# EAGLE design Power_Distro_Board_V3 (EAGLE 8.3.2)
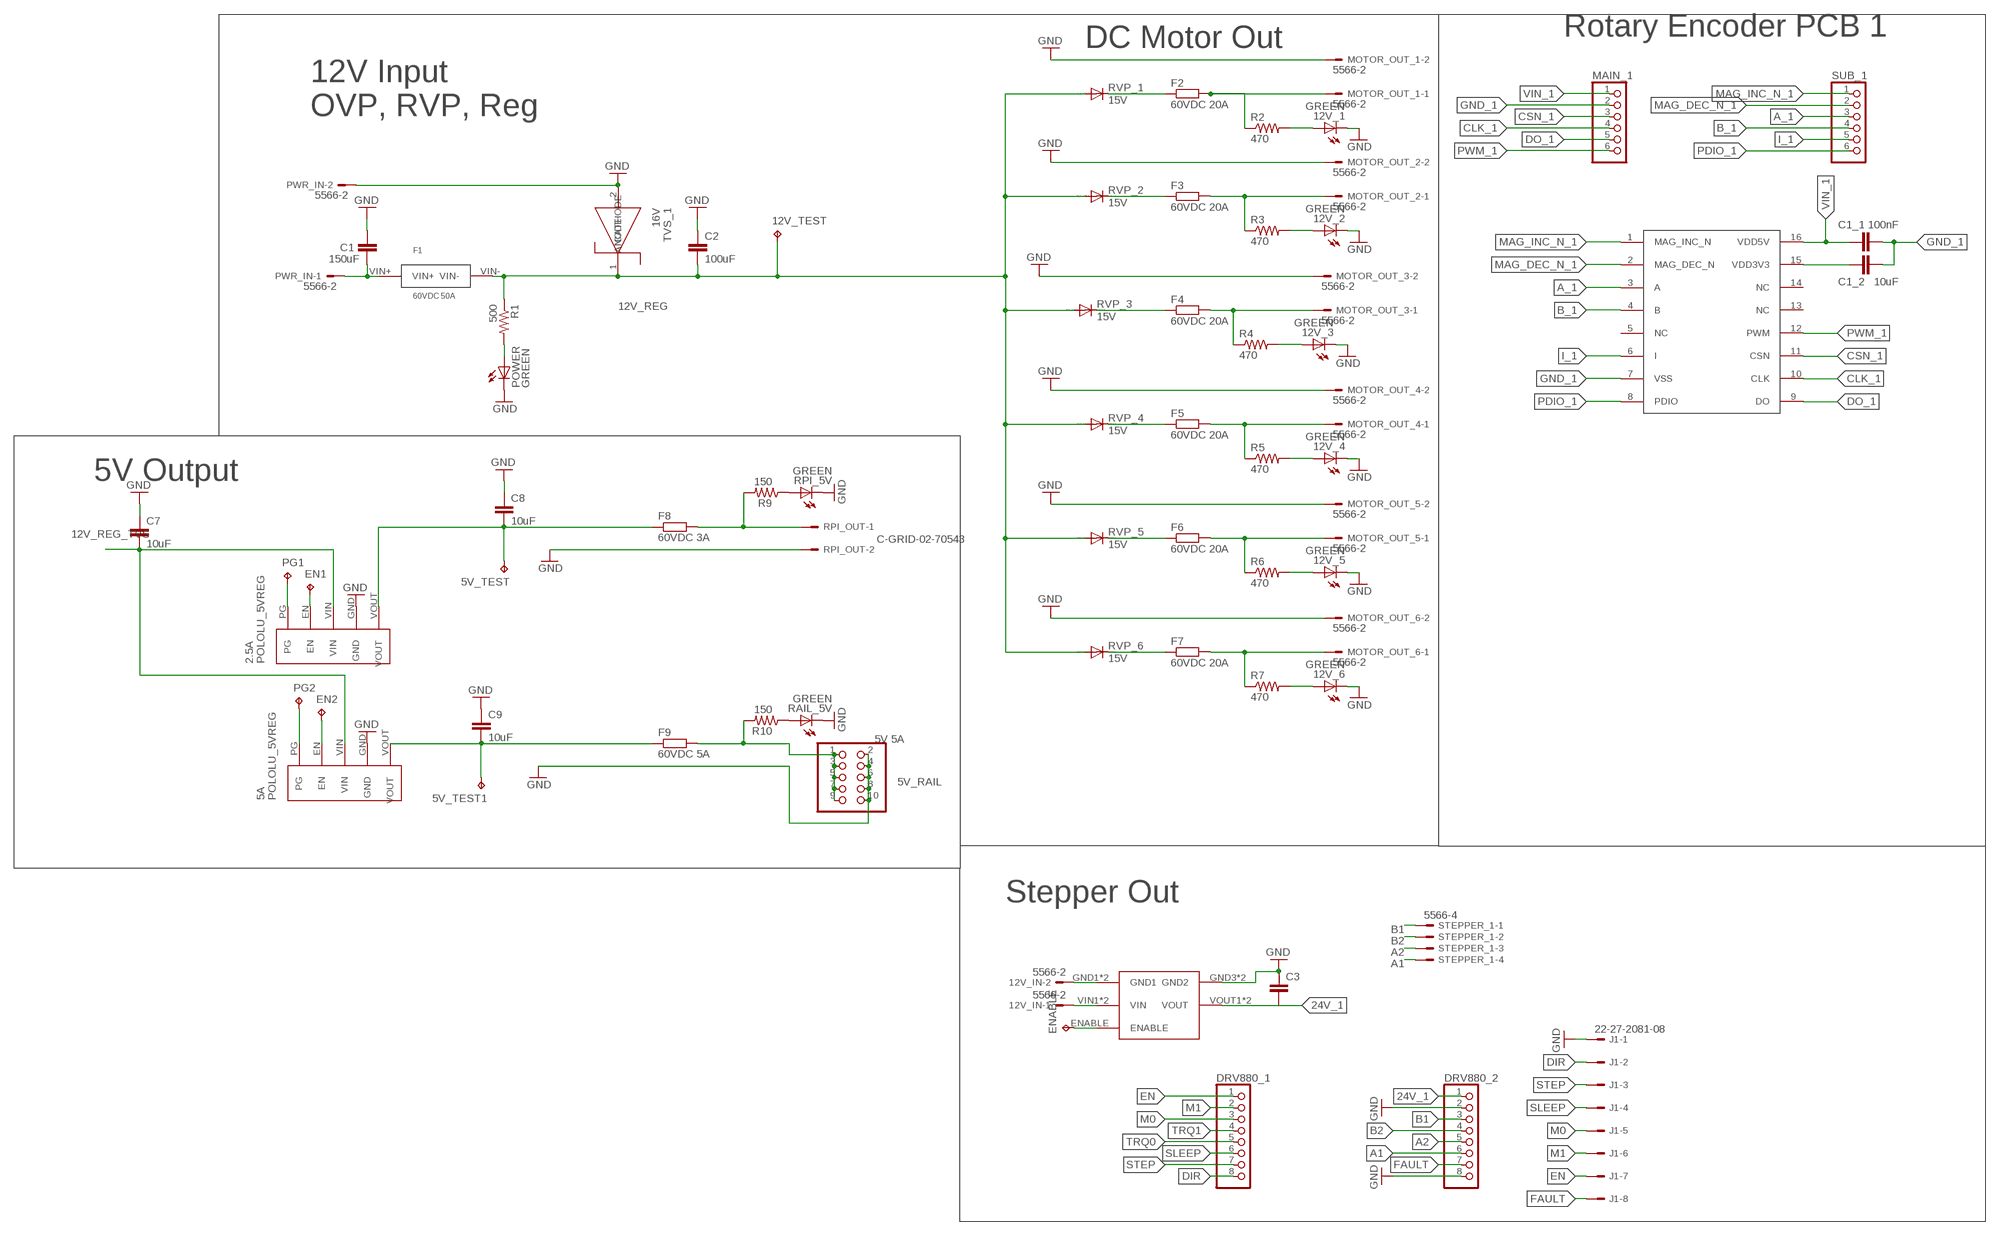
[diagram p0: schematic, sheet 1]

## Parts
2.5A  POLOLU_5VREG  [SIP5]
5A  POLOLU_5VREG  [SIP5]
5V_RAIL  5V 5A  PINHD-2X5  [2X05]
5V_TEST  TPPAD1-13  [P1-13]
5V_TEST1  TPPAD1-13  [P1-13]
12V_1  GREEN  LEDSML1206  [SML1206]
12V_2  GREEN  LEDSML1206  [SML1206]
12V_3  GREEN  LEDSML1206  [SML1206]
12V_4  GREEN  LEDSML1206  [SML1206]
12V_5  GREEN  LEDSML1206  [SML1206]
12V_6  GREEN  LEDSML1206  [SML1206]
12V_IN  5566-2  [5566-2]
12V_TEST  TPPAD1-13  [P1-13]
C1  150uF  C-EUC1206  [C1206]
C1_1  100nF  C-EUC1206  [C1206]
C1_2  10uF  C-EUC1206  [C1206]
C2  100uF  C-EUC1206  [C1206]
C3  C-EUC1206  [C1206]
C7  10uF  C-EUC1206  [C1206]
C8  10uF  C-EUC1206  [C1206]
C9  10uF  C-EUC1206  [C1206]
DRV880_1  PINHD-1X8  [1X08]
DRV880_2  PINHD-1X8  [1X08]
EN1  TPPAD1-13  [P1-13]
EN2  TPPAD1-13  [P1-13]
ENABLE  TPPAD1-13  [P1-13]
ENC_1  ENCODER_AS5045B  [SSOP16]
F1  60VDC 50A  LITTLEFUSENANO463  [NANO]
F2  60VDC 20A  R-EU_R1206W  [R1206W]
F3  60VDC 20A  R-EU_R1206W  [R1206W]
F4  60VDC 20A  R-EU_R1206W  [R1206W]
F5  60VDC 20A  R-EU_R1206W  [R1206W]
F6  60VDC 20A  R-EU_R1206W  [R1206W]
F7  60VDC 20A  R-EU_R1206W  [R1206W]
F8  60VDC 3A  R-EU_R1206W  [R1206W]
F9  60VDC 5A  R-EU_R1206W  [R1206W]
J1  22-27-2081-08  [6410-08]
MAIN_1  PINHD-1X6  [1X06]
MOTOR_OUT_1  5566-2  [5566-2]
MOTOR_OUT_2  5566-2  [5566-2]
MOTOR_OUT_3  5566-2  [5566-2]
MOTOR_OUT_4  5566-2  [5566-2]
MOTOR_OUT_5  5566-2  [5566-2]
MOTOR_OUT_6  5566-2  [5566-2]
PG1  TPPAD1-13  [P1-13]
PG2  TPPAD1-13  [P1-13]
POWER  GREEN  LEDSML1206  [SML1206]
PWR_IN  5566-2  [5566-2]
R1  500  R-US_R1206  [R1206]
R2  470  R-US_R1206  [R1206]
R3  470  R-US_R1206  [R1206]
R4  470  R-US_R1206  [R1206]
R5  470  R-US_R1206  [R1206]
R6  470  R-US_R1206  [R1206]
R7  470  R-US_R1206  [R1206]
R9  150  R-US_R1206  [R1206]
R10  150  R-US_R1206  [R1206]
RAIL_5V  GREEN  LEDSML1206  [SML1206]
RPI_5V  GREEN  LEDSML1206  [SML1206]
RPI_OUT  C-GRID-02-70543  [70543-02]
RVP_1  15V  BYT08P  [TO220ACS]
RVP_2  15V  BYT08P  [TO220ACS]
RVP_3  15V  BYT08P  [TO220ACS]
RVP_4  15V  BYT08P  [TO220ACS]
RVP_5  15V  BYT08P  [TO220ACS]
RVP_6  15V  BYT08P  [TO220ACS]
STEPPER_1  5566-4  [5566-4]
SUB_1  PINHD-1X6  [1X06]
TVS_1  16V  SMAJ26A_TVSSMA  [DO-214AC]
U$1  POLOLU_24VSTEPUP  [2X4PIN_REG]

## Nets
5V_REG: 2.5A.VOUT 5V_TEST.TP C8.2 F8.1
5V_REG1: F8.2 R9.2 RPI_OUT.1
5V_REG3: 5V_RAIL.1 5V_RAIL.3 5V_RAIL.5 5V_RAIL.7 5V_RAIL.9 F9.2 R10.2
12V_REG: 12V_TEST.TP C2.2 F1.VIN- R1.1 RVP_1.A RVP_2.A RVP_3.A RVP_4.A RVP_5.A RVP_6.A TVS_1.1(CATHODE)
12V_REG_TVS: 2.5A.VIN 5A.VIN C7.2
24V_1: DRV880_2.1 U$1.VOUT1(VOUT) U$1.VOUT2(VOUT)
A1: DRV880_2.6 STEPPER_1.4
A2: DRV880_2.5 STEPPER_1.3
A_1: ENC_1.3(A) SUB_1.3
B1: DRV880_2.3 STEPPER_1.1
B2: DRV880_2.4 STEPPER_1.2
B_1: ENC_1.4(B) SUB_1.4
CLK_1: ENC_1.10(CLK) MAIN_1.4
CSN_1: ENC_1.11(CSN) MAIN_1.3
DIR: DRV880_1.8 J1.2
DO_1: ENC_1.9(DO) MAIN_1.5
EN: DRV880_1.1 J1.7
FAULT: DRV880_2.7 J1.8
GND: 2.5A.GND 5A.GND 5V_RAIL.2 5V_RAIL.4 5V_RAIL.6 5V_RAIL.8 5V_RAIL.10 12V_1.C 12V_2.C 12V_3.C 12V_4.C 12V_5.C 12V_6.C C1.1 C2.1 C3.1 C7.1 C8.1 C9.1 DRV880_2.2 DRV880_2.8 J1.1 MOTOR_OUT_1.2 MOTOR_OUT_2.2 MOTOR_OUT_3.2 MOTOR_OUT_4.2 MOTOR_OUT_5.2 MOTOR_OUT_6.2 POWER.C PWR_IN.2 RAIL_5V.C RPI_5V.C RPI_OUT.2 TVS_1.2(ANODE) U$1.GND3(GND2) U$1.GND4(GND2)
GND_1: C1_1.2 C1_2.2 ENC_1.7(VSS) MAIN_1.2
I_1: ENC_1.6(I) SUB_1.5
M0: DRV880_1.3 J1.5
M1: DRV880_1.2 J1.6
MAG_DEC_N_1: ENC_1.2(MAG_DEC_N) SUB_1.2
MAG_INC_N_1: ENC_1.1(MAG_INC_N) SUB_1.1
N$1: POWER.A R1.2
N$2: 2.5A.PG PG1.TP
N$3: C1.2 F1.VIN+ PWR_IN.1
N$4: C1_2.1 ENC_1.15(VDD3V3)
N$5: F2.1 RVP_1.C
N$6: 2.5A.EN EN1.TP
N$7: F6.1 RVP_5.C
N$8: 5A.PG PG2.TP
N$9: 12V_1.A R2.2
N$10: R9.1 RPI_5V.A
N$11: R10.1 RAIL_5V.A
N$12: F2.2 MOTOR_OUT_1.1 R2.1
N$13: 12V_5.A R6.2
N$14: F3.1 RVP_2.C
N$15: 5A.EN EN2.TP
N$16: 12V_2.A R3.2
N$17: F6.2 MOTOR_OUT_5.1 R6.1
N$18: F3.2 MOTOR_OUT_2.1 R3.1
N$20: F7.1 RVP_6.C
N$21: 12V_6.A R7.2
N$22: F4.1 RVP_3.C
N$23: F7.2 MOTOR_OUT_6.1 R7.1
N$24: 12V_3.A R4.2
N$25: F4.2 MOTOR_OUT_3.1 R4.1
N$26: F5.1 RVP_4.C
N$27: 12V_4.A R5.2
N$28: F5.2 MOTOR_OUT_4.1 R5.1
N$29: 12V_IN.2 U$1.GND1 U$1.GND2(GND1)
N$30: 12V_IN.1 U$1.VIN1(VIN) U$1.VIN2(VIN)
N$31: ENABLE.TP U$1.ENABLE
N$32: 5A.VOUT 5V_TEST1.TP C9.2 F9.1
PDIO_1: ENC_1.8(PDIO) SUB_1.6
PWM_1: ENC_1.12(PWM) MAIN_1.6
SLEEP: DRV880_1.6 J1.4
STEP: DRV880_1.7 J1.3
TRQ0: DRV880_1.5
TRQ1: DRV880_1.4
VIN_1: C1_1.1 ENC_1.16(VDD5V) MAIN_1.1
Unconnected: C3.2 ENC_1.5(NC) ENC_1.13(NC) ENC_1.14(NC)

## Notes on the sheet
- **This encoder PCBs will be cut out of the main board
- Rotary Encoder PCB 1
- DC Motor Out
- 12V Input 
  OVP, RVP, Reg
- 5V Output
- Stepper Out
- **The ERC will say that there are no pins on net 12V_REG3, 
  which I have not been able to find anywhere. 
  
  It is not used anywhere too, 
  I think it's a bug in EAGLE.

## Library data of the parts
2.5A 5A = POWER_DISTRO:POLOLU_5VREG: Pololu 5V Regulator Variable Output Current
5V_RAIL = pinhead:PINHD-2X5: PIN HEADER
5V_TEST 5V_TEST1 12V_TEST EN1 EN2 ENABLE PG1 PG2 = testpad:TP: Test pad
12V_1-12V_6 POWER RAIL_5V RPI_5V = led:LED: LED OSRAM: - CHIPLED LG R971, LG N971, LY N971, LG Q971, LY Q971, LO R971, LY R971 LH N974, LH R974 LS Q976, LO Q976, LY Q976 LO Q996 - Hyper CHIPLED LW Q18S LB Q993, LB Q99A, LB R99A - SideLED LS A670, LO A670, LY A670, LG A670, LP A670 LB A673, LV A673, LT A673, LW A673 LH A674 LY A675 LS A676, LA A676, LO A676, LY A676, LW A676 LS A679, LY A679, LG A679 - Hyper Micro SIDELED® LS Y876, LA Y876, LO Y876, LY Y876 LT Y87S - SmartLED LW L88C, LW L88S LB L89C, LB L89S, LG L890 LS L89K, LO L89K, LY L89K LS L896, LA L896, LO L896, LY L896 - TOPLED LS T670, LO T670, LY T670, LG T670, LP T670 LSG T670, LSP T670, LSY T670, LOP T670, LYG T670 LG T671, LOG T671, LSG T671 LB T673, LV T673, LT T673, LW T673 LH T674 LS T676, LA T676, LO T676, LY T676, LB T676, LH T676, LSB T676, LW T676 LB T67C, LV T67C, LT T67C, LS T67K, LO T67K, LY T67K, LW E67C LS E67B, LA E67B, LO E67B, LY E67B, LB E67C, LV E67C, LT E67C LW T67C LS T679, LY T679, LG T679 LS T770, LO T770, LY T770, LG T770, LP T770 LB T773, LV T773, LT T773, LW T773 LH T774 LS E675, LA E675, LY E675, LS T675 LS T776, LA T776, LO T776, LY T776, LB T776 LHGB T686 LT T68C, LB T68C - Hyper Mini TOPLED® LB M676 - Mini TOPLED Santana® LG M470 LS M47K, LO M47K, LY M47K Source: http://www.osram.convergy.de LUXEON: - LUMILED® LXK2-PW12-R00, LXK2-PW12-S00, LXK2-PW14-U00, LXK2-PW14-V00 LXK2-PM12-R00, LXK2-PM12-S00, LXK2-PM14-U00 LXK2-PE12-Q00, LXK2-PE12-R00, LXK2-PE12-S00, LXK2-PE14-T00, LXK2-PE14-U00 LXK2-PB12-K00, LXK2-PB12-L00, LXK2-PB12-M00, LXK2-PB14-N00, LXK2-PB14-P00, LXK2-PB14-Q00 LXK2-PR12-L00, LXK2-PR12-M00, LXK2-PR14-Q00, LXK2-PR14-R00 LXK2-PD12-Q00, LXK2-PD12-R00, LXK2-PD12-S00 LXK2-PH12-R00, LXK2-PH12-S00 LXK2-PL12-P00, LXK2-PL12-Q00, LXK2-PL12-R00 Source: www.luxeon.com KINGBRIGHT: KA-3528ASYC Source: www.kingbright.com
12V_IN MOTOR_OUT_1-MOTOR_OUT_6 PWR_IN = con-molex:5566-2: Mini FIT connector 2 pol Source: http://www.molex.com; OC_FARNELL: 1822072; OC_NEWARK: unknown
C1 C1_1 C1_2 C2 C3 C7-C9 = resistor:C-EU: CAPACITOR, European symbol
DRV880_1 DRV880_2 = pinhead:PINHD-1X8: PIN HEADER
ENC_1 = minebot_PDR:ENCODER_AS5045B
F1 = minebot_PDR:LITTLEFUSENANO463
F2-F9 = resistor:R-EU_: RESISTOR, European symbol
J1 = con-molex:22-?-08: CONNECTOR wire to board 2.54 mm (.1 inch) pitch header; OC_FARNELL: unknown; OC_NEWARK: unknown
MAIN_1 SUB_1 = pinhead:PINHD-1X6: PIN HEADER
R1-R7 R9 R10 = resistor:R-US_: RESISTOR, American symbol
RPI_OUT = con-molex:C-GRID-02: CONNECTOR wire to board 2.54 mm (0.100") pitch header; OC_FARNELL: unknown; OC_NEWARK: unknown
RVP_1-RVP_6 = diode:BYT08P: DIODE ultra fast
STEPPER_1 = con-molex:5566-4: Mini FIT connector 4 pol Source: http://www.molex.com; OC_FARNELL: unknown; OC_NEWARK: unknown
TVS_1 = POWER_DISTRO:SMAJ26A_TVS: TVS Diode, SMAJ26A
U$1 = POWER_DISTRO:POLOLU_24VSTEPUP: Pololu_24VStep-up

## Net classes
0 default: width 0.025 mm, drill 0.254 mm, clearance 0.254 mm
1 Power IN: width 4.801 mm
2 Motor_OUT: width 4.801 mm
3 3.3V_1A: width 0.305 mm
4 5V_1A: width 0.305 mm
5 12V_2A: width 0.813 mm

## Board
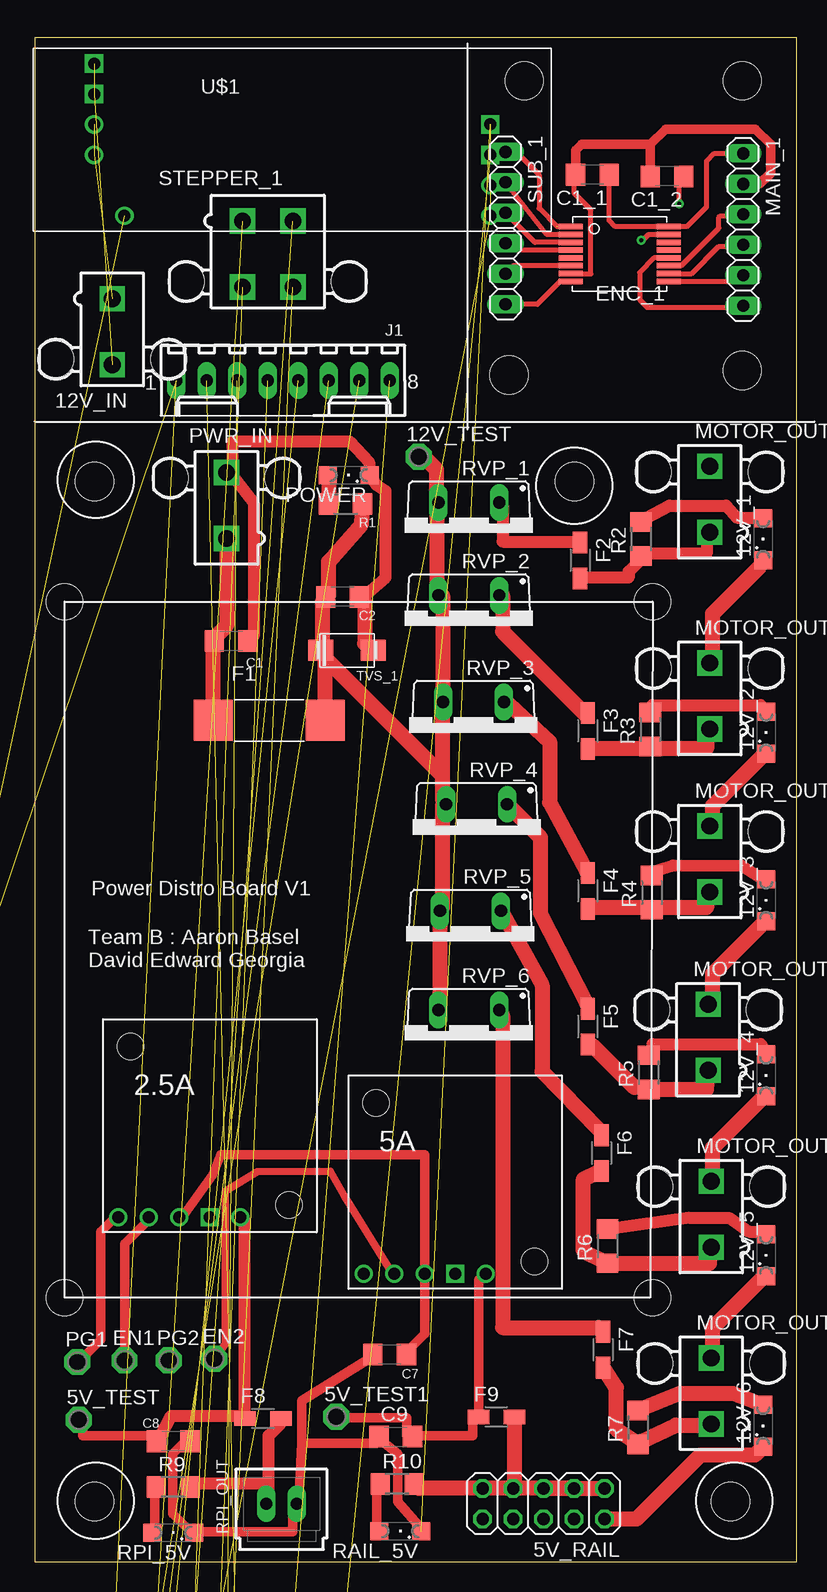
[diagram p1: board, top side]
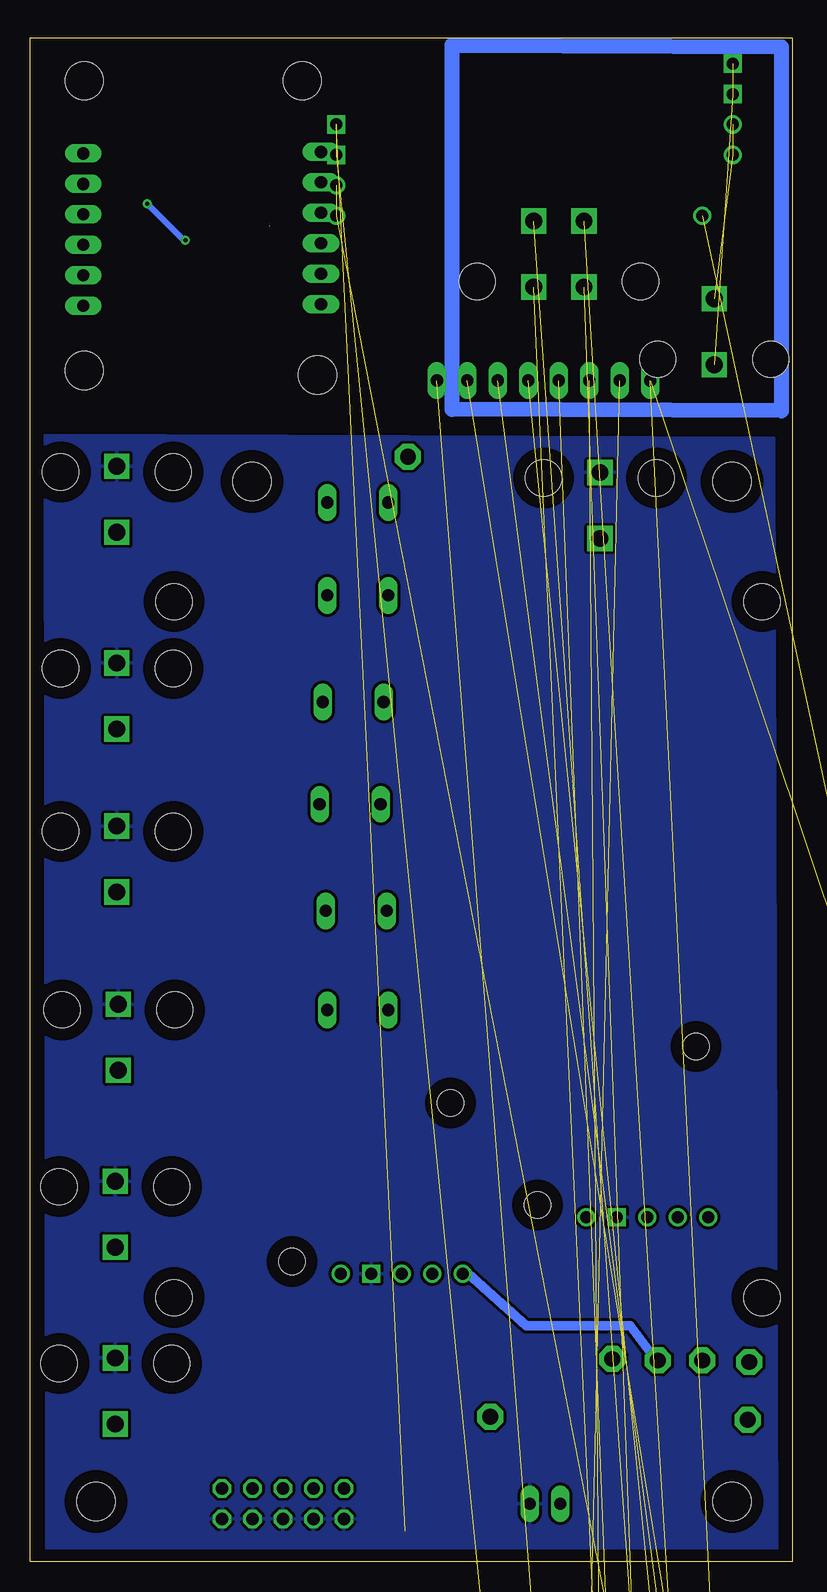
[diagram p2: board, bottom side, seen from below]

Size 63.5 x 127 mm. Coordinates in mm from the lower left corner, seen from the top.
Outline: 0,0 63.5,0 63.5,127 0,127 0,0
Copper layers (1*16): Top 0.035mm / dielectric 1.5mm / Bottom 0.035mm
Design rules "default *": minimum track width 6mil, minimum drill 0.35mm, track to track 6mil, track to pad 6mil, pad to pad 6mil, via to via 6mil, smd to smd 6mil, copper to edge 40mil, drill to drill 6mil, minimum pad ring 10mil, minimum via ring 8mil, stop-mask expansion 4mil, vias tented up to drill 0mil, thermal gap 10mil
Holes 3.17 mm at 5,5 58,5 45,90 5,90 39.54,98.89 58.98,99.27 58.98,123.4 40.81,123.4
Holes 3 mm at 2.5,80 51.5,80 51.5,22 2.5,22

### Footprints (pad centres in the part's own frame; a part is rotated, then mirrored left to right if it is on the bottom)
SIP5 = drill 1: EN -5.08,-7.62; PG -7.62,-7.62; VIN -2.54,-7.62; VOUT 2.54,-7.62 | drill 1 square: GND 0,-7.62 | hole 2.184: 6.604,-6.604; -6.604,6.604
2X05 = drill 1.016 octagon: 1 -5.08,-1.27; 2 -5.08,1.27; 3 -2.54,-1.27; 4 -2.54,1.27; 5 0,-1.27; 6 0,1.27; 7 2.54,-1.27; 8 2.54,1.27; 9 5.08,-1.27; 10 5.08,1.27
P1-13 = drill 1.321 pad 2.159 octagon: TP 0,0
SML1206 = smd 1.5 x 1.5: A 1.75,0; C -1.75,0
5566-2 = drill 1.4 square: 1 0,-2.75; 2 0,2.75 | hole 3: 4.7,2.29; -4.7,2.29
C1206 = smd 1.6 x 1.8: 1 -1.4,0; 2 1.4,0
1X08 = drill 1.016 long: 1 -8.89,0; 2 -6.35,0; 3 -3.81,0; 4 -1.27,0; 5 1.27,0; 6 3.81,0; 7 6.35,0; 8 8.89,0
SSOP16 = smd 2 x 0.46: 1 -4.08,2.275; 2 -4.08,1.625; 3 -4.08,0.975; 4 -4.08,0.325; 5 -4.08,-0.325; 6 -4.08,-0.975; 7 -4.08,-1.625; 8 -4.08,-2.275; 9 4.08,-2.275; 10 4.08,-1.625; 11 4.08,-0.975; 12 4.08,-0.325; 13 4.08,0.325; 14 4.08,0.975; 15 4.08,1.625; 16 4.08,2.275
NANO = smd 3.25 x 3.43: VIN+ -4.675,0; VIN- 4.675,0
R1206W = smd 1.8 x 1.2: 1 -1.499,0; 2 1.499,0
6410-08 = drill 1.016 long: 1 8.89,0; 2 6.35,0; 3 3.81,0; 4 1.27,0; 5 -1.27,0; 6 -3.81,0; 7 -6.35,0; 8 -8.89,0
1X06 = drill 1.016 long: 1 -6.35,0; 2 -3.81,0; 3 -1.27,0; 4 1.27,0; 5 3.81,0; 6 6.35,0
R1206 = smd 1.6 x 1.803: 1 -1.422,0; 2 1.422,0
70543-02 = drill 1.016 long: 1 -1.27,0; 2 1.27,0
TO220ACS = drill 1.016 long: A 2.54,-2.54; C -2.54,-2.54
5566-4 = drill 1.4 square: 1 2.1,-2.75; 2 -2.1,-2.75; 3 2.1,2.75; 4 -2.1,2.75 | hole 3: 6.8,2.29; -6.8,2.29
DO-214AC = smd 2.083 x 1.778: 1 -2.184,0; 2 2.184,0
2X4PIN_REG = drill 1: ENABLE -13.97,-6.35; VIN1 -16.51,1.27; VIN2 -16.51,-1.27; VOUT1 16.51,-3.81; VOUT2 16.51,-6.35 | drill 1 square: GND1 -16.51,6.35; GND2 -16.51,3.81; GND3 16.51,1.27; GND4 16.51,-1.27

### Placement (x,y rotation side)
2.5A  14.61,36.32 0 top
5A  35.05,31.62 0 top
5V_RAIL  42.42,4.83 180 top
5V_TEST  3.68,11.81 0 top
5V_TEST1  25.15,12.06 0 top
12V_1  60.71,85.22 90 top
12V_2  60.96,69.09 90 top
12V_3  60.96,55.12 90 top
12V_4  60.96,40.51 90 top
12V_5  60.96,25.53 90 top
12V_6  60.71,11.3 90 top
12V_IN  6.48,102.49 180 top
12V_TEST  32,92.08 0 top
C1  16.38,76.71 180 top
C1_1  46.48,115.57 180 top
C1_2  52.7,115.44 180 top
C2  25.65,80.39 180 top
C3  -50.93,-92.2 0 top  (outside the outline)
C7  29.59,17.27 0 top
C8  11.56,10.03 180 top
C9  30.1,10.41 0 top
DRV880_1  9.27,-66.17 0 top  (outside the outline)
DRV880_2  9.27,-81.41 0 top  (outside the outline)
EN1  7.49,16.76 0 top
EN2  14.99,16.89 0 top
ENABLE  -42.67,-121.28 0 top  (outside the outline)
ENC_1  48.77,108.97 0 top
F1  19.56,70.1 0 top
F2  45.47,83.44 270 top
F3  46.1,69.22 270 top
F4  46.1,55.88 270 top
F5  46.1,44.58 270 top
F6  47.24,34.04 270 top
F7  47.37,17.65 270 top
F8  19.05,11.94 0 top
F9  38.48,12.06 0 top
J1  20.7,98.42 180 top
MAIN_1  59.05,111 270 top
MOTOR_OUT_1  56.26,88.52 0 top
MOTOR_OUT_2  56.26,72.14 0 top
MOTOR_OUT_3  56.26,58.55 0 top
MOTOR_OUT_4  56.13,43.69 0 top
MOTOR_OUT_5  56.39,28.96 0 top
MOTOR_OUT_6  56.39,14.22 0 top
PG1  3.56,16.64 0 top
PG2  11.18,16.76 0 top
POWER  26.16,90.55 180 top
PWR_IN  16,88.01 0 top
R1  25.91,88.14 180 top
R2  50.55,85.22 90 top
R3  51.31,69.34 90 top
R4  51.44,55.75 90 top
R5  51.18,40.77 90 top
R6  47.75,26.29 90 top
R7  50.29,11.18 90 top
R9  11.56,6.22 0 top
R10  30.23,6.48 0 top
RAIL_5V  30.48,2.54 180 top
RPI_5V  11.56,2.41 180 top
RPI_OUT  20.57,4.83 0 top
RVP_1  36.2,85.72 180 top
RVP_2  36.2,77.98 180 top
RVP_3  36.58,69.09 180 top
RVP_4  36.83,60.58 180 top
RVP_5  36.32,51.69 180 top
RVP_6  36.2,43.43 180 top
STEPPER_1  19.43,108.97 180 top
SUB_1  39.24,111.12 270 top
TVS_1  26.04,75.95 0 top
U$1  21.46,118.49 0 top

### Tracks (layer width: path | path; a pad name or v marks a point on that pad's centre or on a via)
5V_REG
  Top 0.8: 5V_TEST.TP 4,11.5 4,10.5 10,10.5 C8.2 10.5,10.5 | 17.5,28.5 2.5A.VOUT | 17.5,12.13 F8.1 17.5,12 17.5,12.13
  Top 1.016: 10.5,10.5 11.39,12.13 17.5,12.13 17.5,28.5
5V_REG1
  Top 0.8: 20.5,11.5 F8.2 | 19.5,5 RPI_OUT.1 | 13,6.5 R9.2
  Top 1.016: 20.5,11.5 19.5,10.5 19.5,6.5 | 19.5,5 19.5,6.5 | 19.5,6.5 13,6.5
5V_REG3
  Top 1.27: F9.2 39.98,6.2 5V_RAIL.7 | 42.55,6.1 5V_RAIL.7 | 42.55,6.1 5V_RAIL.1 | 5V_RAIL.3 42.55,6.1 | 5V_RAIL.5 5V_RAIL.7 | 5V_RAIL.7 5V_RAIL.9 32.03,6.1 R10.2
12V_REG
  Top 0.8: 24,80 C2.2 24.5,80.5 | 34,71.5 RVP_3.A 34,72 | 34,63.5 RVP_4.A 34,63 | 33.5,81 RVP_2.A 34,80.5 | 33.5,88 RVP_1.A 33.5,88.5 | 32.5,92 12V_TEST.TP | 24,75.5 TVS_1.1 24,76 24.23,75.77 | 34,54.5 RVP_5.A
  Top 1.27: 24,76 24,80 | 24.5,80.5 24.5,83.33 27.25,86.45 R1.1 | 34,63.5 34,65.5 | 34,65.5 34,71.5 | 33.5,88 33.5,81 | 32.5,92 33.5,91 33.5,88.5 | 34,80.5 34,72 | 34,65.5 24,75.5 | 34,54.5 34,63 | F1.VIN- 24.23,75.77 | RVP_5.A 33.78,46.1 RVP_6.A
12V_REG_TVS
  Top 0.8: C7.2 31,17.5 32.5,19 5A.VIN 32.5,24.5 32.5,33.9 15.5,33.9 14.87,32.25 12.5,29 2.5A.VIN
24V_1  (2 unrouted)
A1  (1 unrouted)
A2  (1 unrouted)
A_1
  Top 0.406: ENC_1.3 41.7,109.94 SUB_1.3
B1  (1 unrouted)
B2  (1 unrouted)
B_1
  Top 0.406: ENC_1.4 39.81,109.29 SUB_1.4
CLK_1
  Top 0.406: ENC_1.10 54.76,107.34 57.02,109.6 58.93,109.6
  Top 0.8: 58.93,109.6 MAIN_1.4
CSN_1
  Top 0.406: ENC_1.11 53.89,107.99 57.02,111.12 57.02,112.01 57.15,112.14 58.93,112.14
  Top 0.8: 58.93,112.14 MAIN_1.3
DIR  (1 unrouted)
DO_1
  Top 0.406: ENC_1.9 58.56,106.69 MAIN_1.5
EN  (1 unrouted)
FAULT  (1 unrouted)
GND  (6 unrouted)
  Top 0.8: 27.5,80.5 C2.1 27.5,80 | 27.5,76.5 28,76 TVS_1.2 | RAIL_5V.C 32,3 30.25,5 30.25,9 29,10 C9.1 28.5,9.87 22.25,9.87 | 60.5,23.5 12V_5.C | 56.5,17 MOTOR_OUT_6.2 | 60.5,38.5 12V_4.C | 56.5,32 MOTOR_OUT_5.2 | 60.5,53 12V_3.C | 56.5,46.5 MOTOR_OUT_4.2 | 60.5,67 12V_2.C | 56.5,61.5 MOTOR_OUT_3.2 | 60.5,83 12V_1.C | 56.5,75 MOTOR_OUT_2.2 | C8.1 12.5,10 11.5,9 11.5,4 13,2.5 RPI_5V.C 13.5,2.5 21.5,2.5 21.5,4.5 RPI_OUT.2 22,5 22.25,9.87 | 18.26,77.13 C1.1 | 16.5,90.5 PWR_IN.2 16.5,91 | 22.25,9.87 22.25,13.41 28,17 C7.1
  Top 1.016: 27.5,80.5 29.25,82 29.25,89.21 28.5,89.71 POWER.C 27.87,91.61 26.25,93.36 16.5,93.36 16.5,91 | 18.26,77.13 18.26,88.23 16.5,90.5
  Top 1.27: 27.5,80 27.5,76.5 | 60.5,23.5 56.5,19.5 56.5,17 | 60.5,38.5 56.5,34.5 56.5,32 | 60.5,53 56.5,49 56.5,46.5 | 60.5,67 56.5,63 56.5,61.5 | 60.5,83 56.5,79 56.5,75 | 5V_RAIL.2 50.16,3.56 55.5,8.89 60.04,8.89 12V_6.C
  pour Bottom: 1.52,93.6 1.27,0.64 62.1,0.89 62.23,93.85
GND_1
  Top 0.406: ENC_1.7 46.33,107.34 46.35,107.31 46.35,112.65 44.96,114.05 44.96,115.45
  Top 0.8: MAIN_1.2 60.45,114.81 61.34,115.7 61.34,118.11 60.07,119.38 52.58,119.38 51.31,118.11 | 51.31,118.11 C1_2.2 | 51.31,118.11 45.59,118.11 45.08,117.6 C1_1.2 44.96,115.45
GND_2
  Bottom 1.27: 0.89,126.24 0.89,95.89 28.32,96.01 28.32,126.36 0.89,126.24
I_1
  Top 0.406: ENC_1.6 39.92,107.99 SUB_1.5
M0  (1 unrouted)
M1  (1 unrouted)
MAG_DEC_N_1
  Top 0.406: ENC_1.2 42.7,110.59 SUB_1.2
MAG_INC_N_1  (1 unrouted)
  Top 0.406: ENC_1.1 43.55,111.27 | SUB_1.1 40.13,117.47 42.04,115.57 42.04,112.78 43.53,111.28 44.65,111.28
N$1
  Top 0.8: 24.5,90 24.37,90.48 POWER.A
  Top 1.27: 24.5,90 R1.2
N$2
  Top 0.8: 2.5A.PG 6.5,28.5 5.5,27.5 5.5,18.5 4,17 PG1.TP
N$3
  Top 0.8: 15,77 C1.2 14.88,76.61 | 16,85 PWR_IN.1
  Top 1.27: 15,77 16,78 16,85 | F1.VIN+ 14.88,76.61
N$4  (via drill 0.35)
  Top 0.406: ENC_1.15 51.16,110.59 50.67,110.11 v50.55,110.11 | v53.72,113.16 53.72,115.06
  Top 0.8: 53.72,115.06 C1_2.1
  Bottom 0.5: v50.55,110.11 50.67,110.11 v53.72,113.16
N$5
  Top 0.8: 45,85 F2.1 | 39,88 RVP_1.C
  Top 1.016: 45,85 39,85 39,88
N$6
  Top 0.8: 2.5A.EN 9.5,28.5 7.5,26.5 7.5,17 EN1.TP
N$7
  Top 0.8: 47,36 F6.1 | 39,54 RVP_5.C
  Top 1.27: 47,36 42.29,40.84 42.29,48.05 39,54
N$8
  Bottom 0.8: 5A.PG 27,24 22.13,19.64 13.5,19.64 11.5,17 PG2.TP
N$9
  Top 0.8: 60.5,87 12V_1.A | 51,87 R2.2
  Top 1.016: 60.5,87 58.51,87 57.63,88.01 52.91,88.01 51,87
N$10
  Top 0.8: RPI_5V.A 10,2.5 10,6 R9.1
N$11
  Top 0.8: RAIL_5V.A 28.5,3 28.5,6 R10.1
N$12
  Top 0.8: 45.5,82 F2.2 | 50.5,83.5 R2.1 51,84 | 56,85.5 MOTOR_OUT_1.1
  Top 1.016: 45.5,82 49.5,82 49.5,82.5 50.5,83.5 | 51,84 56,84 56,85.5
N$13
  Top 0.8: 60.5,27.5 12V_5.A
  Top 1.016: 60.5,27.5 59.52,27.5 57.88,28.64 54.6,28.64 R6.2
N$14
  Top 0.8: 46,70.5 F3.1 | 39,80.5 RVP_2.C
  Top 1.27: 46,70.5 39,77.5 39,80.5
N$15
  Top 0.61: 15,17 15.87,18.13 15.87,30.86 18.56,32.51 24.64,32.52 25.79,30.5 29.5,24.5 5A.EN
  Top 0.8: 15,17 EN2.TP
N$16
  Top 0.8: 60.5,71.38 12V_2.A | 51.5,71.38 R3.2
  Top 1.016: 51.5,71.38 60.5,71.38
N$17
  Top 0.8: 47,32.5 F6.2 | 47.5,25 R6.1 48,25 48.25,24.86
  Top 1.27: 47,32.5 45.74,31.87 45.74,25.87 47.5,25 | 48.25,24.86 56.25,24.86 MOTOR_OUT_5.1
N$18
  Top 0.8: 46.5,67.75 F3.2 | 51,67.75 R3.1 51.5,67.75
  Top 1.016: 56,69 MOTOR_OUT_2.1
  Top 1.27: 51,67.75 46.5,67.75 | 51.5,67.75 56,67.75 56,69
N$20
  Top 0.8: 47,19.5 F7.1 | 39,45.5 RVP_6.C
  Top 1.27: 47,19.5 39,19.5 39,45.5
N$21
  Top 1.27: 12V_6.A 58.21,14.02 53.8,14.02 R7.2
N$22
  Top 0.8: 46,57.5 F4.1 | 39.5,71.5 RVP_3.C
  Top 1.27: 46,57.5 42.91,63.25 42.91,68.34 39.5,71.5
N$23
  Top 0.8: 47.5,16 F7.2 | 50,10 R7.1 50.5,10
  Top 1.27: 47.5,16 48.49,14.5 48.49,11 50,10 | 50.5,10 53.42,11.38 56.51,11.38 MOTOR_OUT_6.1
N$24
  Top 0.8: 60.5,57 12V_3.A | 51.5,57.5 R4.2
  Top 1.016: 60.5,57 58.89,58.02 53.18,58.01 51.5,57.5
N$25
  Top 0.8: 46.5,54.5 F4.2 | 51,54.5 R4.1 51.5,54.5 | 56,55.5 MOTOR_OUT_3.1
  Top 1.27: 51,54.5 46.5,54.5 | 51.5,54.5 56,54.5 56,55.5
N$26
  Top 0.8: 46,46.5 F5.1 | 39.5,63 RVP_4.C
  Top 1.27: 46,46.5 42.15,54.03 42.15,60.35 39.5,63
N$27
  Top 1.016: 12V_4.A 60.5,43.13 51.5,43.13 R5.2
N$28
  Top 0.8: 50,39.5 51,39.5 R5.1 51.5,39.5 51.5,39.36 | 46.5,43 F5.2
  Top 1.27: 50,39.5 46.5,43 | 51.5,39.36 56,39.36 MOTOR_OUT_4.1
N$29  (2 unrouted)
N$30  (2 unrouted)
N$31  (1 unrouted)
N$32
  Top 0.8: 5A.VOUT 37.5,24 37,23.5 37,12.5 F9.1 36.5,12 36.5,10.5 31.5,10.5 C9.2 31,10.5 31,12 25.5,12 5V_TEST1.TP
PDIO_1
  Top 0.406: ENC_1.8 43.83,106.69 41.91,104.78 SUB_1.6
PWM_1
  Top 0.406: ENC_1.12 51.62,108.64 50.42,107.44 50.42,105.16 51.05,104.52 58.93,104.52
  Top 0.8: 58.93,104.52 MAIN_1.6
SLEEP  (1 unrouted)
STEP  (1 unrouted)
VIN_1
  Top 0.406: MAIN_1.1 56.64,117.35 56.01,116.71 56.01,112.9 54.34,111.24 ENC_1.16 48.4,111.24 47.88,111.76 C1_1.1
  Top 0.8: C1_1.1

### Text on the board
tNames: Power Distro Board V1 | Team B : Aaron Basel / David Edward Georgia
tDocu: **NOTE : / / There will be 27 DRC overlap errors. / Those are all vias within the GND pad of / the 3 linear voltage regulators included. / These are added on purpose, with thermals generated, / will help with power dissipation to the ground plane / at the bottom.